# EAGLE design main_unit_shield_V1.5 (EAGLE 7.2.0)
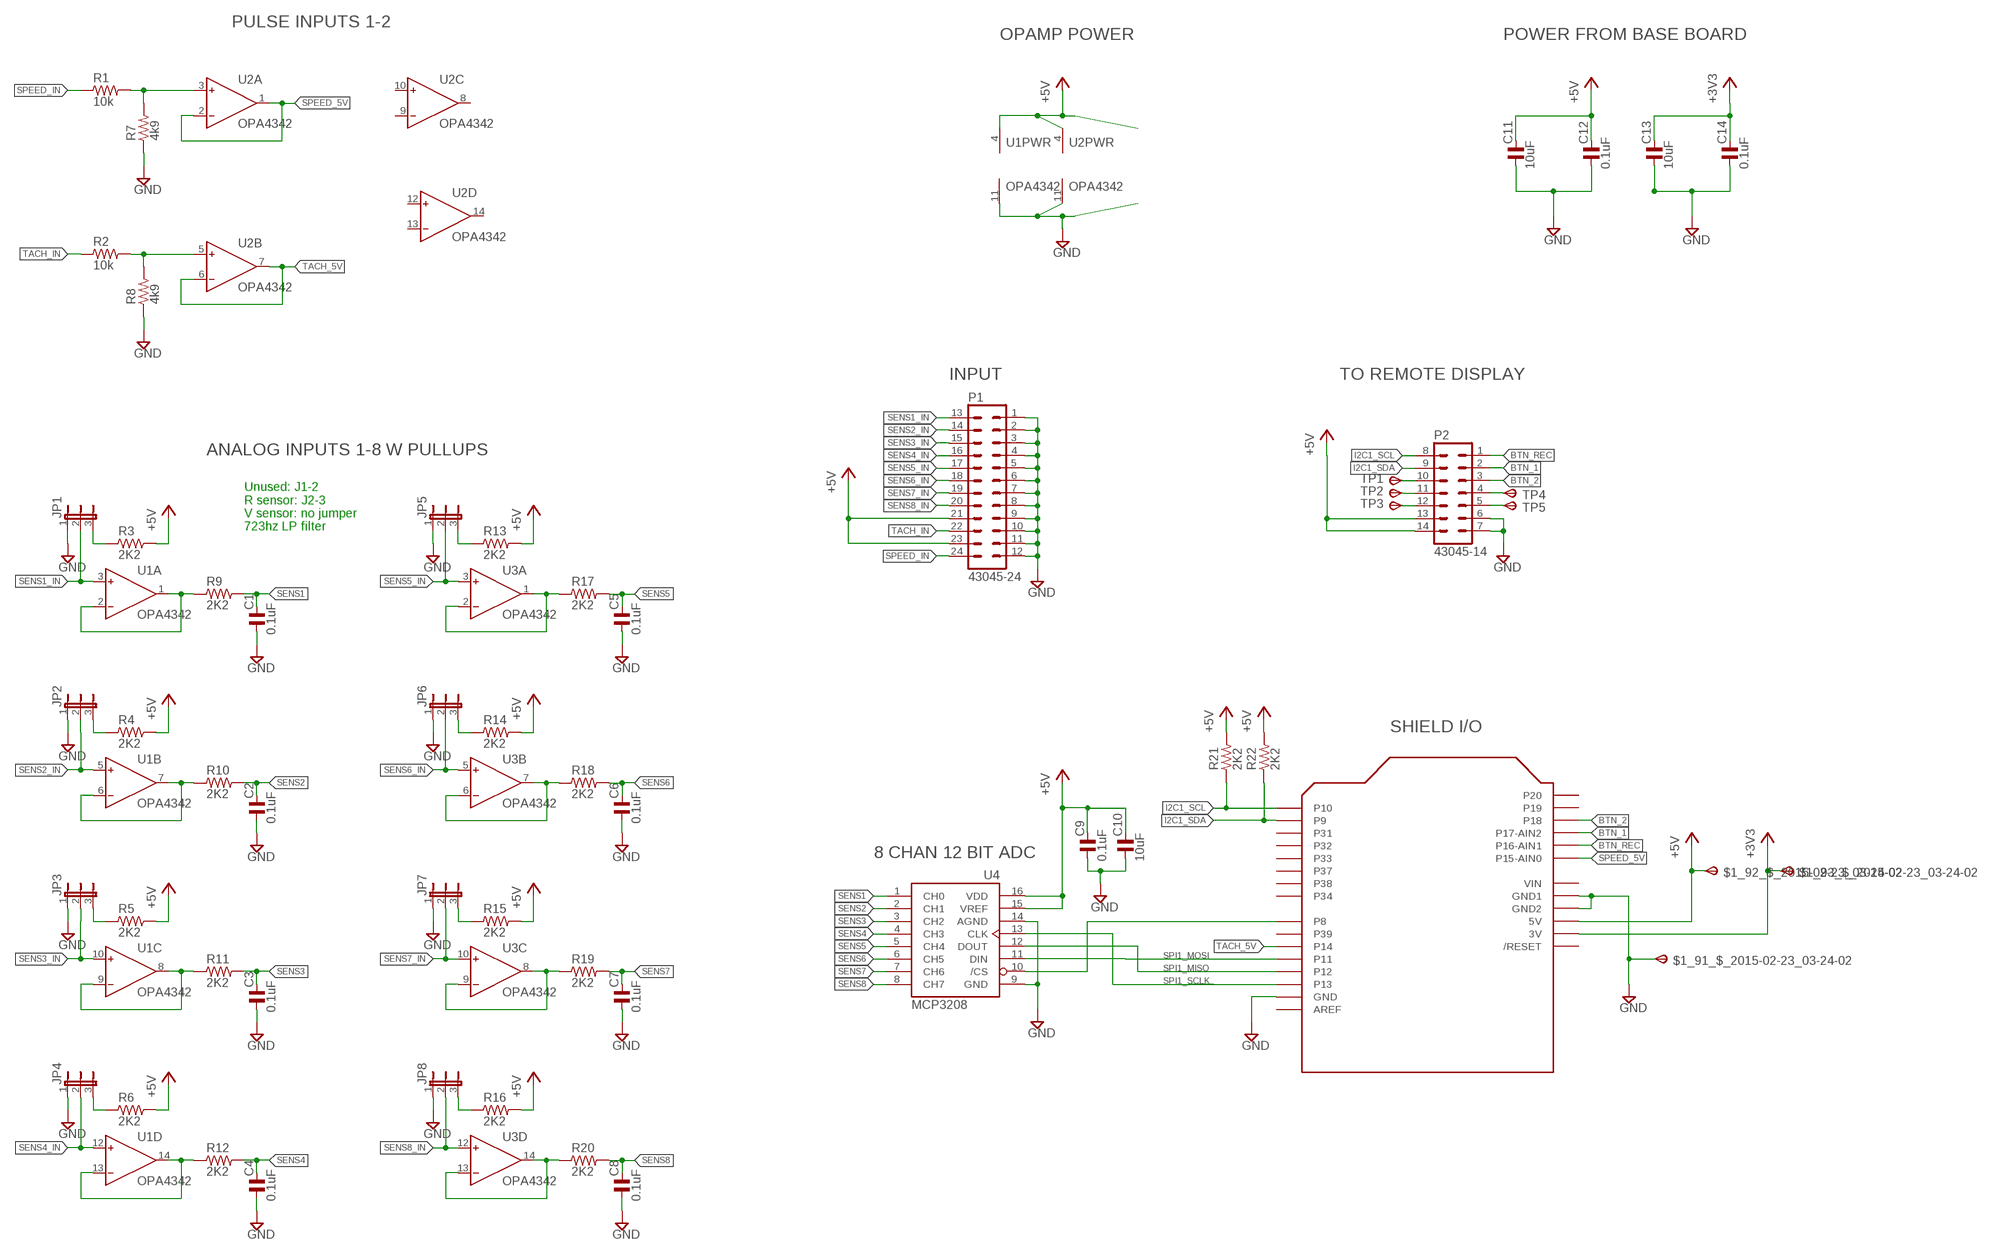
[diagram p0: schematic, sheet 1]

## Parts
$1_91_$_2015-02-23_03-24-02  TPSPAD1-13  [P1-13]
$1_92_$_2015-02-23_03-24-02  TPSPAD1-13  [P1-13]
$1_93_$_2015-02-23_03-24-02  TPSPAD1-13  [P1-13]
C1  0.1uF  C_0805  [C0805]
C2  0.1uF  C_0805  [C0805]
C3  0.1uF  C_0805  [C0805]
C4  0.1uF  C_0805  [C0805]
C5  0.1uF  C_0805  [C0805]
C6  0.1uF  C_0805  [C0805]
C7  0.1uF  C_0805  [C0805]
C8  0.1uF  C_0805  [C0805]
C9  0.1uF  C_0805  [C0805]
C10  10uF  C_0805  [C0805]
C11  10uF  C_0805  [C0805]
C12  0.1uF  C_0805  [C0805]
C13  10uF  C_0805  [C0805]
C14  0.1uF  C_0805  [C0805]
JP1  JP2E  [JP2]
JP2  JP2E  [JP2]
JP3  JP2E  [JP2]
JP4  JP2E  [JP2]
JP5  JP2E  [JP2]
JP6  JP2E  [JP2]
JP7  JP2E  [JP2]
JP8  JP2E  [JP2]
P1  43045-24  [43045-24]
P2  43045-14  [43045-14]
R1  10k  R_0805  [R0805]
R2  10k  R_0805  [R0805]
R3  2K2  R_0805  [R0805]
R4  2K2  R_0805  [R0805]
R5  2K2  R_0805  [R0805]
R6  2K2  R_0805  [R0805]
R7  4k9  R_0805  [R0805]
R8  4k9  R_0805  [R0805]
R9  2K2  R_0805  [R0805]
R10  2K2  R_0805  [R0805]
R11  2K2  R_0805  [R0805]
R12  2K2  R_0805  [R0805]
R13  2K2  R_0805  [R0805]
R14  2K2  R_0805  [R0805]
R15  2K2  R_0805  [R0805]
R16  2K2  R_0805  [R0805]
R17  2K2  R_0805  [R0805]
R18  2K2  R_0805  [R0805]
R19  2K2  R_0805  [R0805]
R20  2K2  R_0805  [R0805]
R21  2K2  R_0805  [R0805]
R22  2K2  R_0805  [R0805]
TP1  TPSPAD1-13  [P1-13]
TP2  TPSPAD1-13  [P1-13]
TP3  TPSPAD1-13  [P1-13]
TP4  TPSPAD1-13  [P1-13]
TP5  TPSPAD1-13  [P1-13]
U1  OPA4342  [SO14]
U2  OPA4342  [SO14]
U3  OPA4342  [SO14]
U4  MCP3208  [SO16]
U6  ARDUINOUNO  [ARDUINO]

## Nets
+3V3: $1_93_$_2015-02-23_03-24-02.TP(PP) C13.2 C14.2 U6.3V
+5V: $1_92_$_2015-02-23_03-24-02.TP(PP) C9.2 C10.2 C11.2 C12.2 P1.21 P1.23 P2.13 P2.14 R3.2 R4.2 R5.2 R6.2 R13.2 R14.2 R15.2 R16.2 R21.2 R22.2 U1.4(PWR:V+) U2.4(PWR:V+) U4.15(VREF) U4.16(VDD) U6.5V
BTN_1: P2.2 U6.A2(P17-AIN2)
BTN_2: P2.3 U6.A3(P18)
BTN_REC: P2.1 U6.A1(P16-AIN1)
GND: $1_91_$_2015-02-23_03-24-02.TP(PP) C1.1 C2.1 C3.1 C4.1 C5.1 C6.1 C7.1 C8.1 C9.1 C10.1 C11.1 C12.1 C13.1 C14.1 JP1.1 JP2.1 JP3.1 JP4.1 JP5.1 JP6.1 JP7.1 JP8.1 P1.1 P1.2 P1.3 P1.4 P1.5 P1.6 P1.7 P1.8 P1.9 P1.10 P1.11 P1.12 P2.6 P2.7 R7.1 R8.1 U1.11(PWR:V-) U2.11(PWR:V-) U4.9(GND) U4.14(AGND) U6.GND U6.GND1 U6.GND2
I2C1_SCL: P2.8 R21.1 U6.D0(P10)
I2C1_SDA: P2.9 R22.1 U6.D1(P9)
N$1: R1.2 R7.2 U2.3(A:IN+)
N$2: JP1.3 R3.1
N$3: R2.2 R8.2 U2.5(B:IN+)
N$4: JP2.3 R4.1
N$5: JP3.3 R5.1
N$6: U4.10(/CS) U6.D8(P8)
N$7: JP5.3 R13.1
N$8: JP4.3 R6.1
N$9: JP6.3 R14.1
N$10: JP7.3 R15.1
N$11: JP8.3 R16.1
N$13: R9.1 U1.1(A:OUT) U1.2(A:IN-)
N$24: P2.10 TP1.TP(PP)
N$25: P2.11 TP2.TP(PP)
N$28: P2.12 TP3.TP(PP)
N$33: P2.4 TP4.TP(PP)
N$36: P2.5 TP5.TP(PP)
SENS1: C1.2 R9.2 U4.1(CH0)
SENS1_BUF1: R17.1 U3.1(A:OUT) U3.2(A:IN-)
SENS1_IN: JP1.2 P1.13 U1.3(A:IN+)
SENS2: C2.2 R10.2 U4.2(CH1)
SENS2_BUF: R10.1 U1.6(B:IN-) U1.7(B:OUT)
SENS2_BUF1: R18.1 U3.6(B:IN-) U3.7(B:OUT)
SENS2_IN: JP2.2 P1.14 U1.5(B:IN+)
SENS3: C3.2 R11.2 U4.3(CH2)
SENS3_BUF: R11.1 U1.8(C:OUT) U1.9(C:IN-)
SENS3_BUF1: R19.1 U3.8(C:OUT) U3.9(C:IN-)
SENS3_IN: JP3.2 P1.15 U1.10(C:IN+)
SENS4: C4.2 R12.2 U4.4(CH3)
SENS4_BUF: R12.1 U1.13(D:IN-) U1.14(D:OUT)
SENS4_BUF1: R20.1 U3.13(D:IN-) U3.14(D:OUT)
SENS4_IN: JP4.2 P1.16 U1.12(D:IN+)
SENS5: C5.2 R17.2 U4.5(CH4)
SENS5_IN: JP5.2 P1.17 U3.3(A:IN+)
SENS6: C6.2 R18.2 U4.6(CH5)
SENS6_IN: JP6.2 P1.18 U3.5(B:IN+)
SENS7: C7.2 R19.2 U4.7(CH6)
SENS7_IN: JP7.2 P1.19 U3.10(C:IN+)
SENS8: C8.2 R20.2 U4.8(CH7)
SENS8_IN: JP8.2 P1.20 U3.12(D:IN+)
SPEED_5V: U2.1(A:OUT) U2.2(A:IN-) U6.A0(P15-AIN0)
SPEED_IN: P1.24 R1.1
SPI1_MISO: U4.12(DOUT) U6.D12(P12)
SPI1_MOSI: U4.11(DIN) U6.D11(P11)
SPI1_SCLK: U4.13(CLK) U6.D13(P13)
TACH_5V: U2.6(B:IN-) U2.7(B:OUT) U6.D10(P14)
TACH_IN: P1.22 R2.1
Unconnected: U2.8(C:OUT) U2.9(C:IN-) U2.10(C:IN+) U2.12(D:IN+) U2.13(D:IN-) U2.14(D:OUT) U6.A4(P19) U6.A5(P20) U6.AREF U6.D2(P31) U6.D3(P32) U6.D4(P33) U6.D5(P37) U6.D6(P38) U6.D7(P34) U6.D9(P39) U6.RESET(/RESET)

## Notes on the sheet
- PULSE INPUTS 1-2
- OPAMP POWER | POWER FROM BASE BOARD
- INPUT | TO REMOTE DISPLAY
- ANALOG INPUTS 1-8 W PULLUPS
- Unused: J1-2
  R sensor: J2-3
  V sensor: no jumper
  723hz LP filter
- SHIELD I/O
- 8 CHAN 12 BIT ADC

## Power pins joined to a net without a drawn wire
V+: U3.4(PWR:V+)
V-: U3.11(PWR:V-)
VIN: U6.VIN

## Library data of the parts
$1_91_$_2015-02-23_03-24-02 $1_92_$_2015-02-23_03-24-02 $1_93_$_2015-02-23_03-24-02 TP1-TP5 = testpad:TPS: TEST PIN; OC_NEWARK: unknown
C1-C9 C12 C14 = rc-master-smd:C_: NON-POLARIZED CAP; MPN: C2012X7R1H104K085AA; OC_NEWARK: 04X3288
C10 C11 C13 = rc-master-smd:C_: NON-POLARIZED CAP; MPN: C2012X5R1E106K125AB; OC_NEWARK: 04X3278
JP1-JP8 = jumper:JP2E: JUMPER
P1 = con-molex-micro-fit:43045-24: HEADER; MF: MOLEX; MPN: 43045-2400; OC_NEWARK: 56H9717
P2 = con-molex-micro-fit:43045-14: HEADER; MPN: 43045-1400; OC_NEWARK: 55R8852
R1 R8 = rc-master-smd:R_: RESISTOR; MPN: CRCW08058K20FKEAHP; OC_NEWARK: 41R4811
R2 R7 = rc-master-smd:R_: RESISTOR; MF: VISHAY/DALE; MPN: CRCW080520K0FKEA; OC_NEWARK: 52K9995
R3-R6 R9-R22 = rc-master-smd:R_: RESISTOR; MF: VISHAY/DALE; MPN: CRCW08052K20FKEA; OC_NEWARK: 52K9951
U1-U3 = dan:OPA4342
U4 = dan:MCP3208; MF: MICROCHIP; MPN: MCP3208-BI/SL; OC_NEWARK: 23C2843
U6 = adafruit:ARDUINO: Arduino Diecimila/Duemilanove Make a shield with ease, this package has all the named pins as well as the two mounting drill holes and an outline of the USB and DC power connector. The outline is on the DIMENSION layer, so if your board house uses it they will cut the outline to match. http://www.ladyada.net/library/pcb/eaglelibrary.html; OC_NEWARK: unknown

## Board
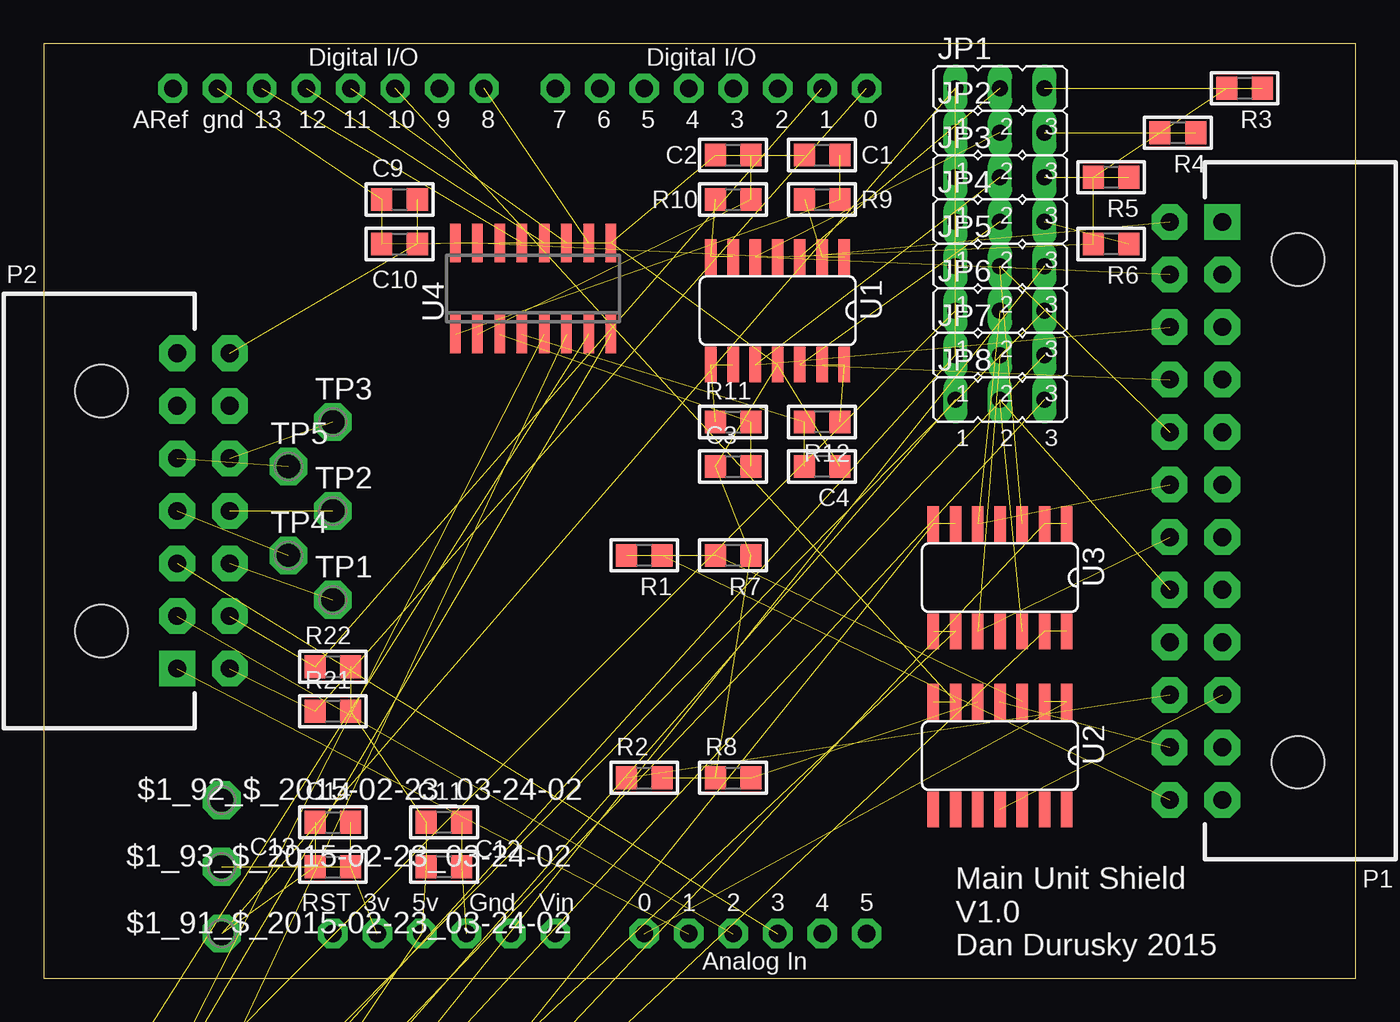
[diagram p1: board, top side]
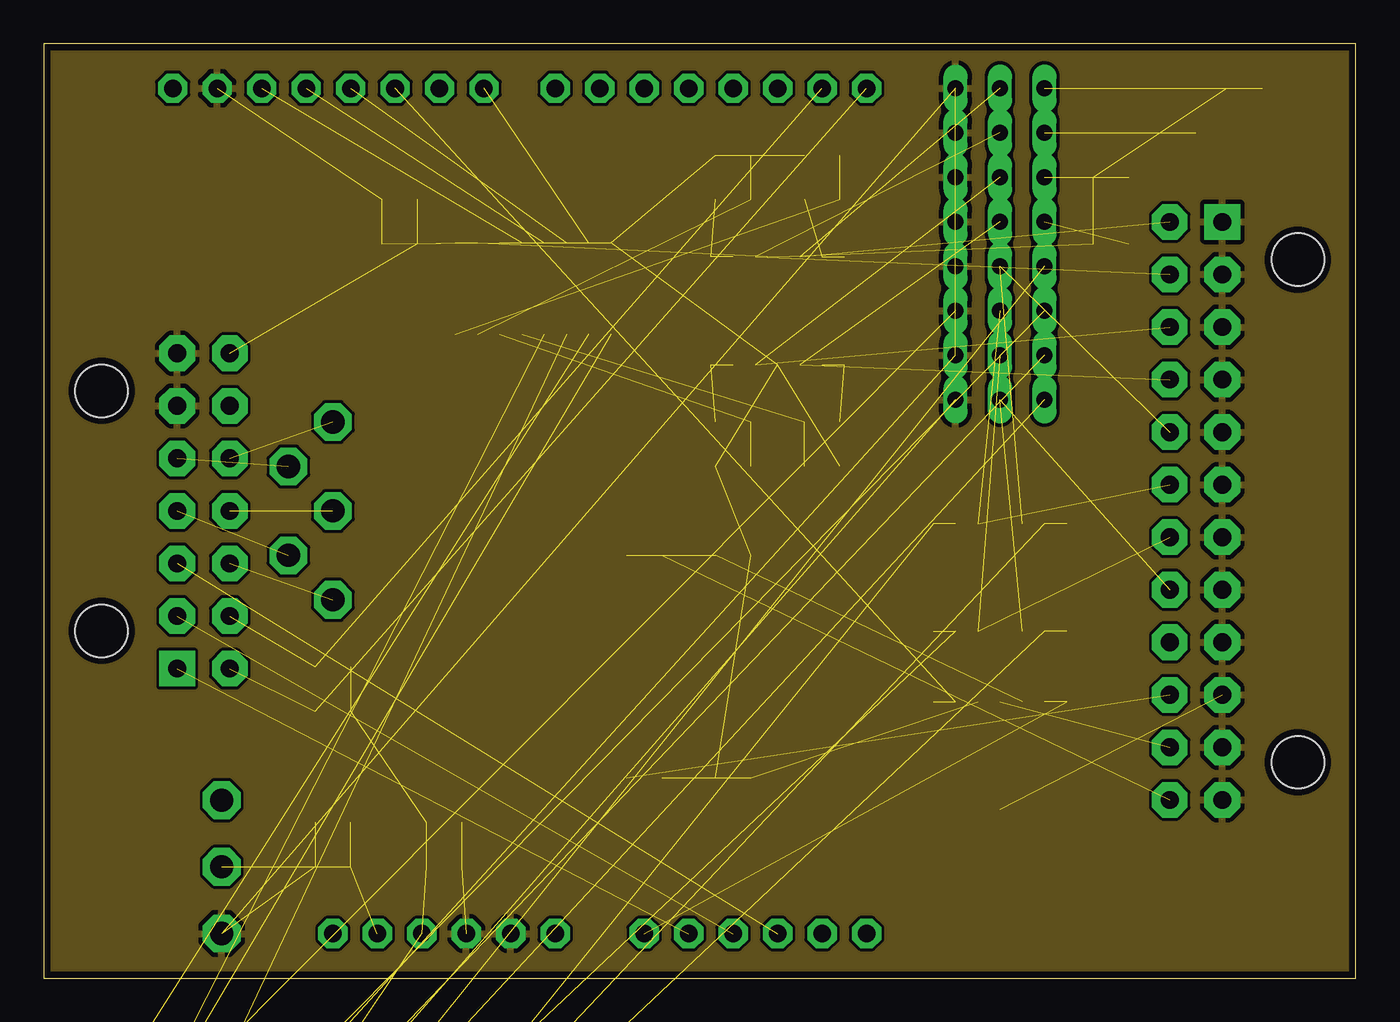
[diagram p2: board, inner layer GroundPlane]
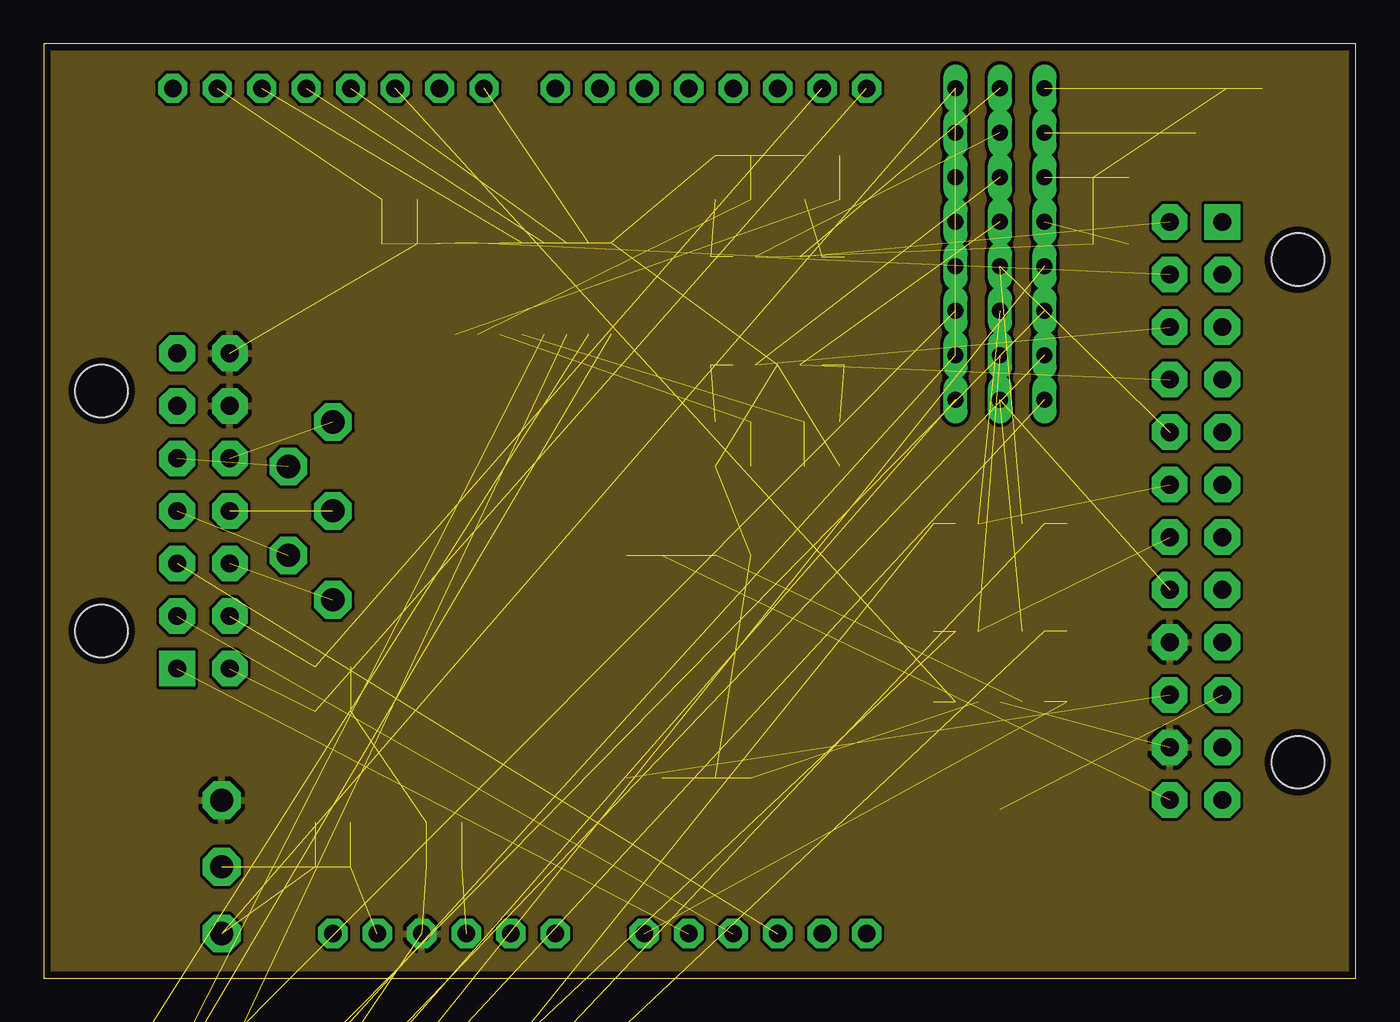
[diagram p3: board, inner layer PowerPlane]

Size 74.93 x 53.34 mm. Coordinates in mm from the lower left corner, seen from the top.
Copper layers (1*2*15*16): Top 0.035559375mm / dielectric 0.17018125mm / GroundPlane 0.01778125mm / dielectric 47mil / PowerPlane 0.01778125mm / dielectric 0.17018125mm / Bottom 0.035559375mm
Design rules "OSHPark-4layer *": minimum track width 7mil, minimum drill 10mil, track to track 7mil, track to pad 7mil, pad to pad 7mil, via to via 7mil, smd to smd 7mil, copper to edge 15mil, drill to drill 6mil, minimum pad ring 4mil, minimum via ring 4mil, stop-mask expansion 4mil, vias tented up to drill 0mil, thermal gap 10mil

### Footprints (pad centres in the part's own frame; a part is rotated, then mirrored left to right if it is on the bottom)
P1-13 = drill 1.321 pad 2.159 octagon: TP 0,0
C0805 = smd 1.2 x 1.3: 1 -1.016,0; 2 1.016,0
JP2 = drill 0.914 long: 1 -2.54,0; 2 0,0; 3 2.54,0
43045-24 = drill 1.016 pad 2.032 square: 1 16.5,0 | drill 1.016 pad 2.032 octagon: 2 13.5,0; 3 10.5,0; 4 7.5,0; 5 4.5,0; 6 1.5,0; 7 -1.5,0; 8 -4.5,0; 9 -7.5,0; 10 -10.5,0; 11 -13.5,0; 12 -16.5,0; 13 16.5,3; 14 13.5,3; 15 10.5,3; 16 7.5,3; 17 4.5,3; 18 1.5,3; 19 -1.5,3; 20 -4.5,3; 21 -7.5,3; 22 -10.5,3; 23 -13.5,3; 24 -16.5,3 | hole 3: -14.35,-4.32; 14.35,-4.32
43045-14 = drill 1.016 pad 2.032 square: 1 9,0 | drill 1.016 pad 2.032 octagon: 2 6,0; 3 3,0; 4 0,0; 5 -3,0; 6 -6,0; 7 -9,0; 8 9,3; 9 6,3; 10 3,3; 11 0,3; 12 -3,3; 13 -6,3; 14 -9,3 | hole 3: -6.85,-4.32; 6.85,-4.32
R0805 = smd 1.2 x 1.3: 1 -1.016,0; 2 1.016,0
SO14 = smd 0.66 x 2.032: 1 -3.81,-3.073; 2 -2.54,-3.073; 3 -1.27,-3.073; 4 0,-3.073; 5 1.27,-3.073; 6 2.54,-3.073; 7 3.81,-3.073; 8 3.81,3.073; 9 2.54,3.073; 10 1.27,3.073; 11 0,3.073; 12 -1.27,3.073; 13 -2.54,3.073; 14 -3.81,3.073
SO16 = smd 0.6 x 2.2: 1 -4.445,-2.6; 2 -3.175,-2.6; 3 -1.905,-2.6; 4 -0.635,-2.6; 5 0.635,-2.6; 6 1.905,-2.6; 7 3.175,-2.6; 8 4.445,-2.6; 9 4.445,2.6; 10 3.175,2.6; 11 1.905,2.6; 12 0.635,2.6; 13 -0.635,2.6; 14 -1.905,2.6; 15 -3.175,2.6; 16 -4.445,2.6
ARDUINO = drill 1 pad 1.676 octagon: 3V 19.05,2.54; 5V 21.59,2.54; A0 34.29,2.54; A1 36.83,2.54; A2 39.37,2.54; A3 41.91,2.54; A4 44.45,2.54; A5 46.99,2.54; AREF 7.366,50.8; D0 46.99,50.8; D1 44.45,50.8; D2 41.91,50.8; D3 39.37,50.8; D4 36.83,50.8; D5 34.29,50.8; D6 31.75,50.8; D7 29.21,50.8; D8 25.146,50.8; D9 22.606,50.8; D10 20.066,50.8; D11 17.526,50.8; D12 14.986,50.8; D13 12.446,50.8; GND 9.906,50.8; GND1 26.67,2.54; GND2 24.13,2.54; RESET 16.51,2.54; VIN 29.21,2.54

### Placement (x,y rotation side)
$1_91_$_2015-02-23_03-24-02  10.16,2.54 0 top
$1_92_$_2015-02-23_03-24-02  10.16,10.16 0 top
$1_93_$_2015-02-23_03-24-02  10.16,6.35 0 top
C1  44.45,46.99 0 top
C2  39.37,46.99 0 top
C3  39.37,29.21 0 top
C4  44.45,29.21 180 top
C5  -35.56,-50.8 0 top  (outside the outline)
C6  -30.48,-50.8 0 top  (outside the outline)
C7  -25.4,-50.8 0 top  (outside the outline)
C8  -20.32,-50.8 0 top  (outside the outline)
C9  20.32,44.45 0 top
C10  20.32,41.91 0 top
C11  22.86,8.89 180 top
C12  22.86,6.35 180 top
C13  16.51,6.35 0 top
C14  16.51,8.89 0 top
JP1  54.61,50.8 0 top
JP2  54.61,48.26 0 top
JP3  54.61,45.72 0 top
JP4  54.61,43.18 0 top
JP5  54.61,40.64 0 top
JP6  54.61,38.1 0 top
JP7  54.61,35.56 0 top
JP8  54.61,33.02 0 top
P1  67.31,26.67 90 top
P2  7.62,26.67 270 top
R1  34.29,24.13 180 top
R2  34.29,11.43 0 top
R3  68.58,50.8 180 top
R4  64.77,48.26 180 top
R5  60.96,45.72 180 top
R6  60.96,41.91 180 top
R7  39.37,24.13 180 top
R8  39.37,11.43 0 top
R9  44.45,44.45 0 top
R10  39.37,44.45 0 top
R11  39.37,31.75 0 top
R12  44.45,31.75 180 top
R13  -15.24,-50.8 0 top  (outside the outline)
R14  -35.56,-57.15 0 top  (outside the outline)
R15  -30.48,-57.15 0 top  (outside the outline)
R16  -25.4,-57.15 0 top  (outside the outline)
R17  -20.32,-57.15 0 top  (outside the outline)
R18  -15.24,-57.15 0 top  (outside the outline)
R19  -35.56,-63.5 0 top  (outside the outline)
R20  -30.48,-63.5 0 top  (outside the outline)
R21  16.51,15.24 0 top
R22  16.51,17.78 0 top
TP1  16.51,21.59 0 top
TP2  16.51,26.67 0 top
TP3  16.51,31.75 0 top
TP4  13.97,24.13 0 top
TP5  13.97,29.21 0 top
U1  41.91,38.1 180 top
U2  54.61,12.7 180 top
U3  54.61,22.86 180 top
U4  27.94,39.37 0 top
U6  0,0 0 top

### Tracks (layer width: path | path; a pad name or v marks a point on that pad's centre or on a via)
+3V3  (3 unrouted)
+5V  (18 unrouted)
  pour PowerPlane: -1.27,54.61 76.2,54.61 76.2,-1.27 -1.27,-1.27
BTN_1  (1 unrouted)
BTN_2  (1 unrouted)
BTN_REC  (1 unrouted)
GND  (28 unrouted)
  pour GroundPlane: -1.27,97.79 153.67,97.79 153.67,-1.27 -1.27,-1.27
  pour GroundPlane: -1.27,54.61 76.2,54.61 76.2,-1.27 -1.27,-1.27
I2C1_SCL  (2 unrouted)
I2C1_SDA  (2 unrouted)
N$1  (2 unrouted)
N$2  (1 unrouted)
N$3  (2 unrouted)
N$4  (1 unrouted)
N$5  (1 unrouted)
N$6  (1 unrouted)
N$7  (1 unrouted)
N$8  (1 unrouted)
N$9  (1 unrouted)
N$10  (1 unrouted)
N$11  (1 unrouted)
N$13  (2 unrouted)
N$24  (1 unrouted)
N$25  (1 unrouted)
N$28  (1 unrouted)
N$33  (1 unrouted)
N$36  (1 unrouted)
SENS1  (2 unrouted)
SENS1_BUF1  (2 unrouted)
SENS1_IN  (2 unrouted)
SENS2  (2 unrouted)
SENS2_BUF  (2 unrouted)
SENS2_BUF1  (2 unrouted)
SENS2_IN  (2 unrouted)
SENS3  (2 unrouted)
SENS3_BUF  (2 unrouted)
SENS3_BUF1  (2 unrouted)
SENS3_IN  (2 unrouted)
SENS4  (2 unrouted)
SENS4_BUF  (2 unrouted)
SENS4_BUF1  (2 unrouted)
SENS4_IN  (2 unrouted)
SENS5  (2 unrouted)
SENS5_IN  (2 unrouted)
SENS6  (2 unrouted)
SENS6_IN  (2 unrouted)
SENS7  (2 unrouted)
SENS7_IN  (2 unrouted)
SENS8  (2 unrouted)
SENS8_IN  (2 unrouted)
SPEED_5V  (2 unrouted)
SPEED_IN  (1 unrouted)
SPI1_MISO  (1 unrouted)
SPI1_MOSI  (1 unrouted)
SPI1_SCLK  (1 unrouted)
TACH_5V  (2 unrouted)
TACH_IN  (1 unrouted)

### Text on the board
tNames: Main Unit Shield / V1.0 / Dan Durusky 2015